# Altium schematic sheet RS485 Channel 4.SchDoc: RS485 Channel-1
size 292 x 193 mm; SheetNumber: 22; SheetTotal: 40
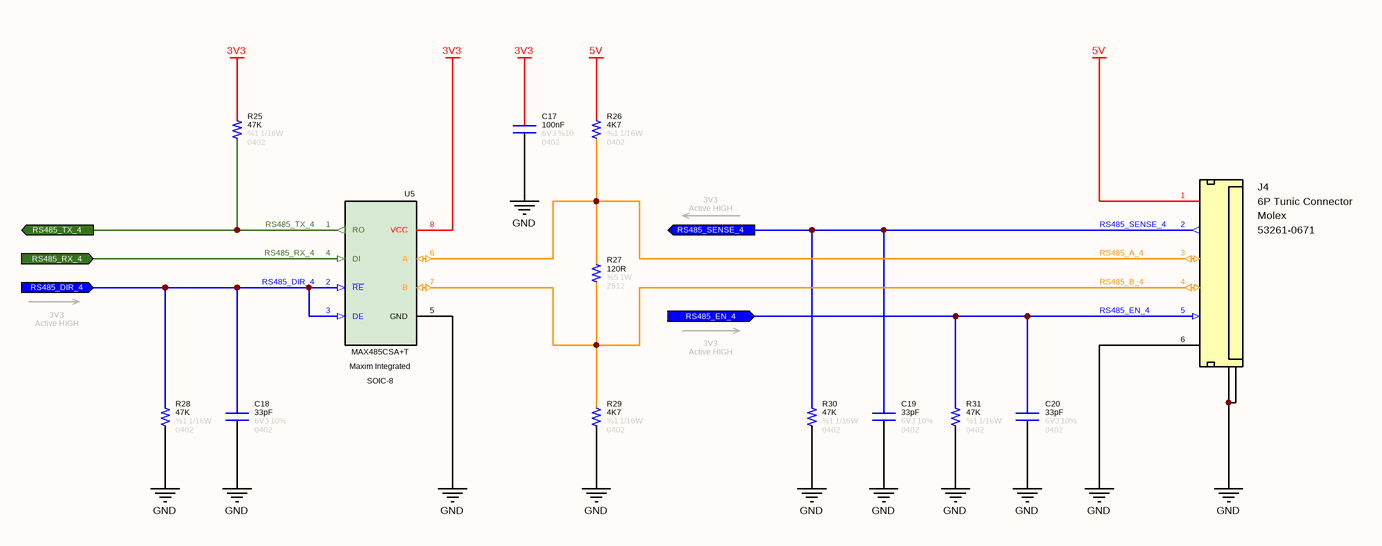
[diagram p0: RS485 Channel 4.SchDoc]

## Parts
C17  value 100nF  Tolerance: %10  Voltage: 6V3  Case: 0402  [CAPACITOR_0402]  (hidden comment: Capacitor - 100nF [0402] (Ceramic))
C18  value 33pF  Tolerance: 10%  Case: 0402  Voltage: 6V3  [CAPACITOR_0402]  (hidden comment: Capacitor - 33pF [0402] (Ceramic))
C19  value 33pF  Tolerance: 10%  Case: 0402  Voltage: 6V3  [CAPACITOR_0402]  (hidden comment: Capacitor - 33pF [0402] (Ceramic))
C20  value 33pF  Tolerance: 10%  Case: 0402  Voltage: 6V3  [CAPACITOR_0402]  (hidden comment: Capacitor - 33pF [0402] (Ceramic))
J4  6P Tunic Connector  Manufacturer Part Number: 53261-0671  Manufacturer Name: Molex  [Connector_Tunic 6P]
R25  value 47K  Tolerance: %1  Case: 0402  Power: 1/16W  [RESISTOR_0402]  (hidden comment: 47K - 0402 - %1 - 1/16W)
R26  value 4K7  Tolerance: %1  Case: 0402  Power: 1/16W  [RESISTOR_0402]  (hidden comment: 4K7 - 0402 - %1 - 1/16W)
R27  value 120R  Tolerance: %5  Case: 2512  Power: 1W  [RESISTOR_2512]  (hidden comment: 120R - 2512 - %5 - 1W)
R28  value 47K  Tolerance: %1  Case: 0402  Power: 1/16W  [RESISTOR_0402]  (hidden comment: 47K - 0402 - %1 - 1/16W)
R29  value 4K7  Tolerance: %1  Case: 0402  Power: 1/16W  [RESISTOR_0402]  (hidden comment: 4K7 - 0402 - %1 - 1/16W)
R30  value 47K  Tolerance: %1  Case: 0402  Power: 1/16W  [RESISTOR_0402]  (hidden comment: 47K - 0402 - %1 - 1/16W)
R31  value 47K  Tolerance: %1  Case: 0402  Power: 1/16W  [RESISTOR_0402]  (hidden comment: 47K - 0402 - %1 - 1/16W)
U5  Case: SOIC-8  Manufacturer Part Number: MAX485CSA+T  Manufacturer Name: Maxim Integrated  [SOP-8L (AZRS3080E)]  (hidden comment: RS485 Modulator)

## Ports
RS485_DIR_4 (in), RS485_EN_4 (in), RS485_RX_4 (in), RS485_SENSE_4 (out), RS485_TX_4 (out)

## Nets
3V3: C17.2 R25.2 U5.8(VCC)
5V: J4.1(5V) R26.2
GND: C17.1 C18.1 C19.1 C20.1 J4.6(GND) J4.7(GND) J4.8(GND) R28.1 R29.1 R30.1 R31.1 U5.5(GND)
RS485_A_4: J4.3(RS485-A) R26.1 R27.2 U5.6(A)
RS485_B_4: J4.4(RS485-B) R27.1 R29.2 U5.7(B)
RS485_DIR_4: C18.2 R28.2 U5.2(~{RE}) U5.3(DE) ; port RS485_DIR_4
RS485_EN_4: C20.2 J4.5(INT) R31.2 ; port RS485_EN_4
RS485_RX_4: U5.4(DI) ; port RS485_RX_4
RS485_SENSE_4: C19.2 J4.2(Sense) R30.2 ; port RS485_SENSE_4
RS485_TX_4: R25.1 U5.1(RO) ; port RS485_TX_4

## Notes on the sheet
- 3V3
  Active HIGH
- © 2021 All rights reserved.
  This document may not, in whole or in part, be copied, photocopied, reproduced, translated or converted to any electronic or machine readable from without prior written permission of Mehmet Günce Akkoyun.
  Engineer contact : akkoyun@me.com
- Property of
- Engineer :
- Date :
- Size :
- A4
- Time :
- Project :
- Page :
- /
- Customer :
- Product ID :
- Module ID :
- Version :
- File :
- Revision :

## Library data of the parts
C17 = Capacitor - 100nF [0402-6V3]: Capacitor - 100nF [0402-6V3] (Ceramic); Manufacturer Name: AVX; Manufacturer Part Number: 04026D104KAT4A; ComponentLink1Description: Mouser; ComponentLink1URL: https://www.mouser.com.tr/ProductDetail/AVX/04026D104KAT4A?qs=sGAEpiMZZMs0AnBnWHyRQPg4iYkCw7IMED%2F4kpqgf7w%3D; ComponentLink2Description: DataSheet; ComponentLink2URL: https://www.mouser.com.tr/datasheet/2/40/cx5r-776519.pdf
C18-C20 = Capacitor - 33pF [0402-6V3]: Manufacturer Name: Kemet; Manufacturer Part Number: C0402C330J9RACAUTO; ComponentLink1Description: DataSheet; ComponentLink1URL: https://api.kemet.com/component-edge/download/datasheet/C0402C330J9RACAUTO.pdf; ComponentLink2Description: Mouser; ComponentLink2URL: https://www.mouser.com/Search/Refine.aspx?Keyword=80-C0402C330J9RAUTO
J4 = Connector - Mini Tunic 6P (1.25): Mini Tunic Connector with 6P; ROHS: Yes
R25 R28 R30 R31 = Resistor - 47K [0402]: Thick Film Resistors - SMD 1/16 W 47 KOhm 1%; Manufacturer Name: Vishay; Manufacturer Part Number: CRCW040247K0FKED; ComponentLink1Description: DataSheet; ComponentLink1URL: https://www.mouser.com.tr/datasheet/2/427/dcrcwe3-1762152.pdf; ComponentLink2Description: Mouser; ComponentLink2URL: https://www.mouser.com.tr/ProductDetail/Vishay-Dale/CRCW040247K0FKED?qs=sGAEpiMZZMu61qfTUdNhG2DpbjADlD3GL%252B3h1elTxqU%3D
R26 R29 = Resistor - 4K7 [0402]: Thick Film Resistors - SMD 1/16 W 4.7 KOhm 1%; Manufacturer Name: Vishay; Manufacturer Part Number: CRCW04024K70FKED; ComponentLink1Description: DataSheet; ComponentLink1URL: https://www.mouser.com.tr/datasheet/2/427/dcrcwe3-1762152.pdf; ComponentLink2Description: Mouser; ComponentLink2URL: https://www.mouser.com.tr/ProductDetail/Vishay-Dale/CRCW04024K70FKED?qs=sGAEpiMZZMu61qfTUdNhG7nHf%2F6MTUn3HadIdDQu24Q%3D
R27 = Resistor - 120R [2512]: Thick Film Resistors - SMD 1 W 120 Ohm 5%; Manufacturer Name: YAGEO; Manufacturer Part Number: RC2512JK-07120RL; ComponentLink1Description: DataSheet; ComponentLink1URL: https://www.mouser.com.tr/datasheet/2/447/PYu_RC_Group_51_RoHS_L_11-1984063.pdf
U5 = IC - MAX485CSA+T: RS-422/RS-485 Interface IC Low-Power, Slew-Rate-Limited RS-485/RS-422 Transceivers; RoHS: Yes